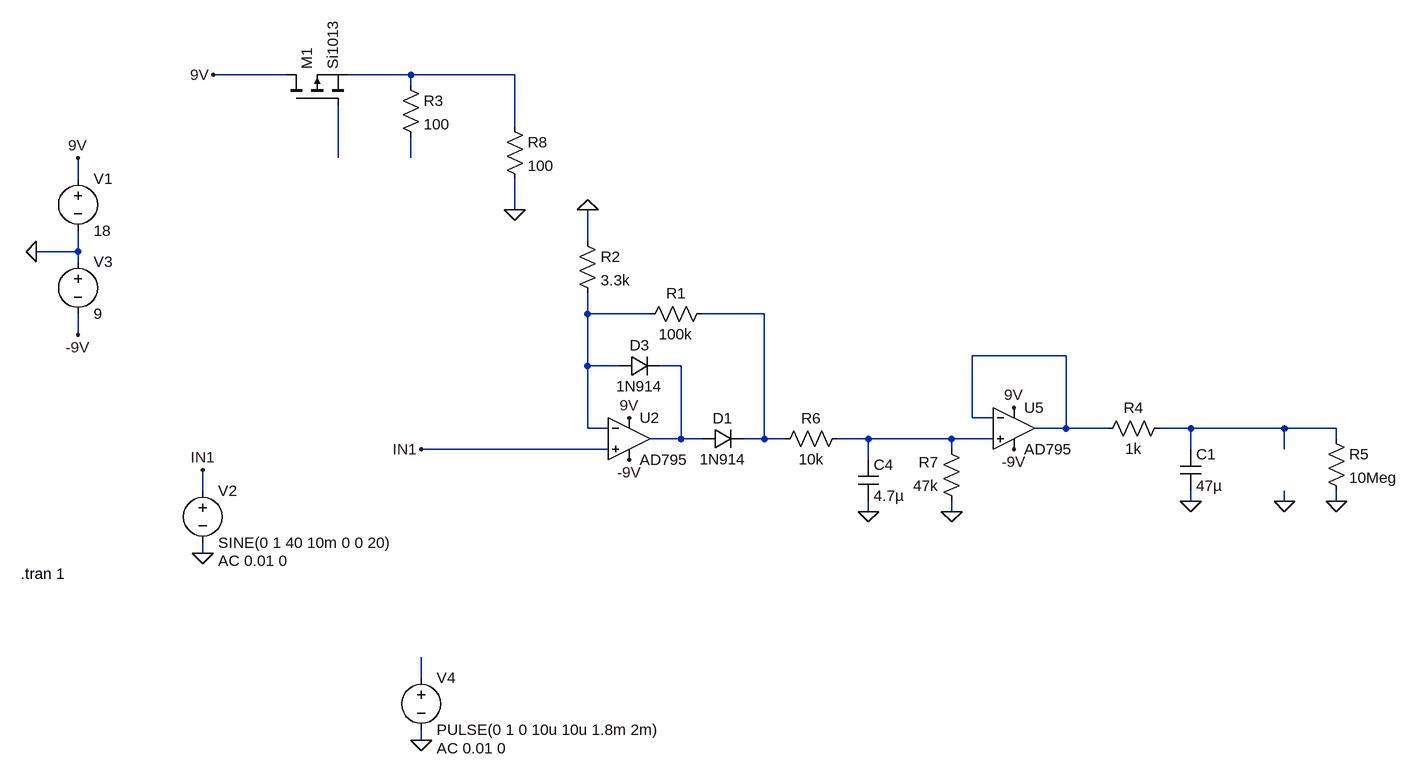
[diagram p0: schematic Envelope_Detector.asc]
Envelope_Detector.asc, the LTspice schematic file:
Version 4
SHEET 1 2100 908
WIRE -48 -144 -160 -144
WIRE 144 -144 48 -144
WIRE 304 -144 144 -144
WIRE 144 -128 144 -144
WIRE 304 -64 304 -144
WIRE 32 -16 32 -96
WIRE 144 -16 144 -48
WIRE -368 16 -368 -16
WIRE 304 64 304 16
WIRE 416 112 416 64
WIRE -368 128 -368 96
WIRE -368 128 -432 128
WIRE -368 144 -368 128
WIRE 416 224 416 192
WIRE 512 224 416 224
WIRE 688 224 592 224
WIRE -368 256 -368 224
WIRE 1152 288 1008 288
WIRE 416 304 416 224
WIRE 464 304 416 304
WIRE 560 304 528 304
WIRE 1008 384 1008 288
WIRE 1040 384 1008 384
WIRE 416 400 416 304
WIRE 448 400 416 400
WIRE 1152 400 1152 288
WIRE 1152 400 1104 400
WIRE 1216 400 1152 400
WIRE 1344 400 1296 400
WIRE 1488 400 1344 400
WIRE 1568 400 1488 400
WIRE 560 416 560 304
WIRE 560 416 512 416
WIRE 592 416 560 416
WIRE 688 416 688 224
WIRE 688 416 656 416
WIRE 720 416 688 416
WIRE 848 416 800 416
WIRE 976 416 848 416
WIRE 1040 416 976 416
WIRE 1568 416 1568 400
WIRE 448 432 160 432
WIRE 976 432 976 416
WIRE 1344 432 1344 400
WIRE 1488 432 1488 400
WIRE 848 448 848 416
WIRE -176 496 -176 464
WIRE 1344 512 1344 496
WIRE 1488 512 1488 496
WIRE 1568 512 1568 496
WIRE 848 528 848 512
WIRE 976 528 976 512
WIRE -176 592 -176 576
WIRE 160 784 160 752
WIRE 160 880 160 864
FLAG -368 -16 9V
FLAG -176 592 0
FLAG -432 128 0
FLAG -368 256 -9V
FLAG 480 448 -9V
FLAG 480 384 9V
FLAG 160 432 IN1
FLAG 416 64 0
FLAG 1344 512 0
FLAG 1488 512 0
FLAG 1072 432 -9V
FLAG 1072 368 9V
FLAG 848 528 0
FLAG 976 528 0
FLAG 1568 512 0
FLAG 160 880 0
FLAG -176 464 IN1
FLAG -160 -144 9V
FLAG 304 64 0
SYMBOL voltage -368 0 R0
WINDOW 123 0 0 Left 2
WINDOW 39 0 0 Left 2
SYMATTR InstName V1
SYMATTR Value 18
SYMBOL voltage -176 480 R0
WINDOW 123 24 124 Left 2
WINDOW 39 24 152 Left 2
SYMATTR Value2 AC 0.01 0
SYMATTR InstName V2
SYMATTR Value SINE(0 1 40 10m 0 0 20)
SYMBOL voltage -368 128 R0
WINDOW 123 0 0 Left 2
WINDOW 39 0 0 Left 2
SYMATTR InstName V3
SYMATTR Value 9
SYMBOL diode 592 432 R270
WINDOW 0 32 32 VTop 2
WINDOW 3 0 32 VBottom 2
SYMATTR InstName D1
SYMATTR Value 1N914
SYMBOL res 608 208 R90
WINDOW 0 0 56 VBottom 2
WINDOW 3 32 56 VTop 2
SYMATTR InstName R1
SYMATTR Value 100k
SYMBOL res 400 96 R0
SYMATTR InstName R2
SYMATTR Value 3.3k
SYMBOL cap 1328 432 R0
SYMATTR InstName C1
SYMATTR Value 47µ
SYMBOL res 1312 384 R90
WINDOW 0 0 56 VBottom 2
WINDOW 3 32 56 VTop 2
SYMATTR InstName R4
SYMATTR Value 1k
SYMBOL diode 464 320 R270
WINDOW 0 32 32 VTop 2
WINDOW 3 0 32 VBottom 2
SYMATTR InstName D3
SYMATTR Value 1N914
SYMBOL Opamps\\AD795 480 352 R0
SYMATTR InstName U2
SYMBOL Opamps\\AD795 1072 336 R0
SYMATTR InstName U5
SYMBOL cap 832 448 R0
SYMATTR InstName C4
SYMATTR Value 4.7µ
SYMBOL res 816 400 R90
WINDOW 0 0 56 VBottom 2
WINDOW 3 32 56 VTop 2
SYMATTR InstName R6
SYMATTR Value 10k
SYMBOL res 992 528 R180
WINDOW 0 36 76 Left 2
WINDOW 3 36 40 Left 2
SYMATTR InstName R7
SYMATTR Value 47k
SYMBOL res 1552 400 R0
SYMATTR InstName R5
SYMATTR Value 10Meg
SYMBOL voltage 160 768 R0
WINDOW 123 24 124 Left 2
WINDOW 39 24 152 Left 2
SYMATTR Value2 AC 0.01 0
SYMATTR InstName V4
SYMATTR Value PULSE(0 1 0 10u 10u 1.8m 2m)
SYMBOL pmos -48 -96 R270
SYMATTR InstName M1
SYMATTR Value Si1013
SYMBOL res 288 -80 R0
SYMATTR InstName R8
SYMATTR Value 100
SYMBOL res 128 -144 R0
SYMATTR InstName R3
SYMATTR Value 100
TEXT -456 624 Left 2 !.tran 1

The netlist it stands for:
* Envelope_Detector.asc
V1 9V 0 18
V2 IN1 0 SINE(0 1 40 10m 0 0 20) AC 0.01 0
V3 0 -9V 9
D1 N007 N005 1N914
R1 N005 N004 100k
R2 0 N004 3.3k
C1 N008 0 47µ
R4 N008 N006 1k
D3 N004 N007 1N914
XU2 IN1 N004 9V -9V N007 AD795  ; pins In+ In- V+ V- OUT
XU5 N009 N006 9V -9V N006 AD795  ; pins In+ In- V+ V- OUT
C4 N009 0 4.7µ
R6 N009 N005 10k
R7 0 N009 47k
R5 N008 0 10Meg
V4 N010 0 PULSE(0 1 0 10u 10u 1.8m 2m) AC 0.01 0
M1 9V N002 N001 N001 Si1013
R8 N001 0 100
R3 N001 N003 100
.model D D
.lib standard.dio
.model NMOS NMOS
.model PMOS PMOS
.lib standard.mos
.tran 1
.lib ADI1.lib
.backanno
.end